# EAGLE design breakout (EAGLE 9.2.2)
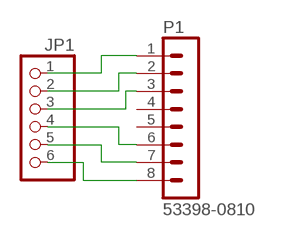
[diagram p0: schematic, sheet 1]

## Parts
JP1  PINHD-1X6  [1X06]
P1  53398-0810  [53398-0810]

## Nets
3.3V: JP1.1 P1.1
GND: JP1.6 P1.8
NC: JP1.3 P1.3
RX: JP1.5 P1.7
TX: JP1.4 P1.6
VCC: JP1.2 P1.2
Unconnected: P1.4 P1.5

## Library data of the parts
JP1 = pinhead:PINHD-1X6: PIN HEADER
P1 = con-molex-picoblade:53398-0810: HEADER

## Board
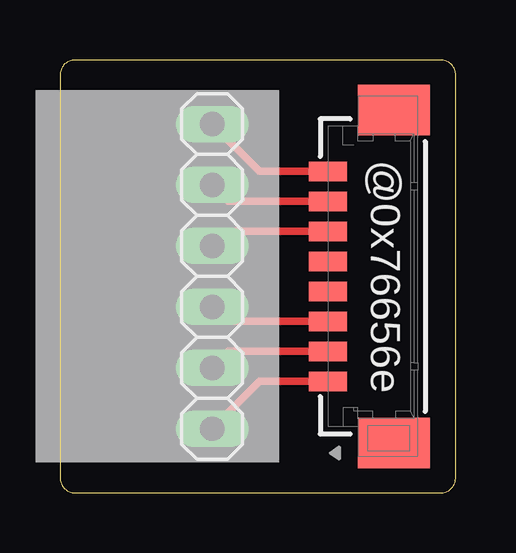
[diagram p1: board, top side]
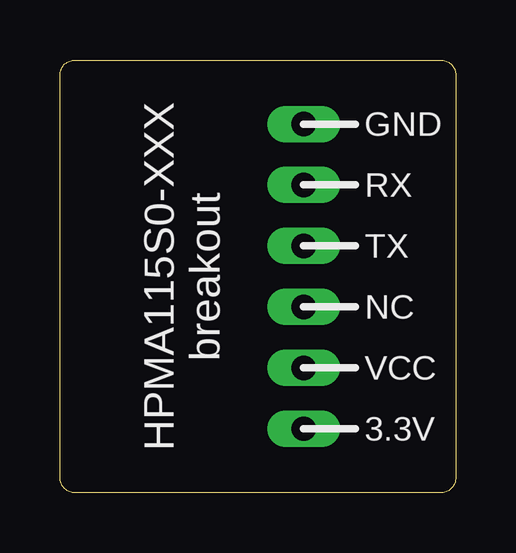
[diagram p2: board, bottom side, seen from below]

Size 16.51 x 18.03 mm. Coordinates in mm from the lower left corner, seen from the top.
Outline: 15.88,18.03 0.63,18.03 arc90 0,17.4 0,0.63 arc90 0.63,0 15.88,0 arc90 16.51,0.63 16.51,17.4 arc90 15.88,18.03
Copper layers (1*16): Top 0.035mm / dielectric 1.5mm / Bottom 0.035mm
Design rules "default": minimum track width 6mil, minimum drill 0.35mm, track to track 6mil, track to pad 6mil, pad to pad 6mil, via to via 6mil, smd to smd 6mil, copper to edge 40mil, drill to drill 6mil, minimum pad ring 10mil, minimum via ring 8mil, stop-mask expansion 4mil, vias tented up to drill 0mil, thermal gap 10mil

### Footprints (pad centres in the part's own frame; a part is rotated, then mirrored left to right if it is on the bottom)
1X06 = drill 1.016 long: 1 -6.35,0; 2 -3.81,0; 3 -1.27,0; 4 1.27,0; 5 3.81,0; 6 6.35,0
53398-0810 = smd 0.8 x 1.6: 1 4.375,0; 2 3.125,0; 3 1.875,0; 4 0.625,0; 5 -0.625,0; 6 -1.875,0; 7 -3.125,0; 8 -4.375,0 | smd 2.1 x 3: M1 6.935,2.75; M2 -6.935,2.75

### Placement (x,y rotation side)
JP1  6.35,9.02 90 top
P1  11.18,9.02 270 top

### Tracks (layer width: path | path; a pad name or v marks a point on that pad's centre or on a via)
3.3V
  Top 0.305: P1.1 8.32,4.64 JP1.1
GND
  Top 0.305: P1.8 8.32,13.39 JP1.6
NC
  Top 0.305: JP1.3 6.95,7.14 P1.3
RX
  Top 0.305: JP1.5 7.04,12.14 P1.7
TX
  Top 0.305: JP1.4 6.95,10.89 P1.6
VCC
  Top 0.305: JP1.2 7.04,5.89 P1.2

### Text on the board
tPlace: @0x76656e
bPlace: GND | RX | TX | HPMA115S0-XXX / breakout | NC | VCC | 3.3V